# Altium schematic sheet Regulator.SchDoc
size A; SheetNumber: 4; SheetTotal: 7
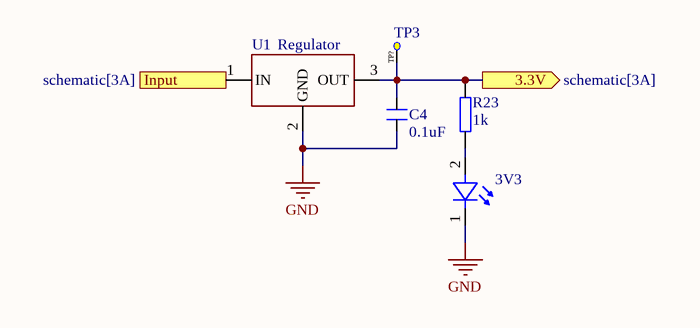
[diagram p0: Regulator.SchDoc]

## Parts
3V3  led  [LED_fp]  (value not drawn)
C4  0.1uF  [CAP_0805]
R23  1k  [RES0402]
TP3  test_point  [Test_point]  (value not drawn)
U1  Regulator  [TC1108]

## Ports
3.3V (out, see schematic[3A]), Input (in, see schematic[3A])

## Nets
GND: 3V3.1 C4.1 U1.2(GND)
3.3V: C4.2 R23.2 TP3.TP?(Test_Point) U1.3(OUT) ; port 3.3V
Input: U1.1(IN) ; port Input
Net3V3_2: 3V3.2 R23.1

## Library data of the parts
C4 = CAP_0805
R23 = RES 0402
U1 = Regulator: CJ117 or TC1108